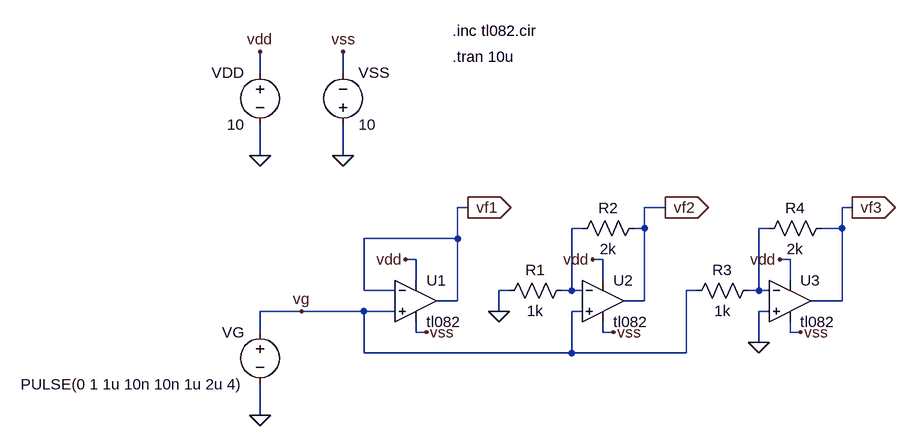
[diagram p0: schematic Experiment_01.asc]
Experiment_01.asc, the LTspice schematic file:
Version 4
SHEET 1 948 680
WIRE -64 -176 -64 -208
WIRE 64 -176 64 -208
WIRE -64 -48 -64 -96
WIRE 64 -48 64 -96
WIRE 256 32 240 32
WIRE 560 32 528 32
WIRE 848 32 832 32
WIRE 432 64 416 64
WIRE 528 64 528 32
WIRE 528 64 512 64
WIRE 720 64 704 64
WIRE 832 64 832 32
WIRE 832 64 800 64
WIRE 240 80 240 32
WIRE 240 80 96 80
WIRE 176 112 160 112
WIRE 464 112 448 112
WIRE 752 112 736 112
WIRE 176 144 176 112
WIRE 464 144 464 112
WIRE 752 144 752 112
WIRE 96 160 96 80
WIRE 144 160 96 160
WIRE 320 160 304 160
WIRE 416 160 416 64
WIRE 416 160 400 160
WIRE 432 160 416 160
WIRE 608 160 592 160
WIRE 704 160 704 64
WIRE 704 160 688 160
WIRE 720 160 704 160
WIRE 240 176 240 80
WIRE 240 176 208 176
WIRE 528 176 528 64
WIRE 528 176 496 176
WIRE 832 176 832 64
WIRE 832 176 784 176
WIRE 0 192 -64 192
WIRE 96 192 0 192
WIRE 144 192 96 192
WIRE 304 192 304 160
WIRE 432 192 416 192
WIRE 720 192 704 192
WIRE -64 224 -64 192
WIRE 176 224 176 208
WIRE 192 224 176 224
WIRE 464 224 464 208
WIRE 480 224 464 224
WIRE 752 224 752 208
WIRE 768 224 752 224
WIRE 704 240 704 192
WIRE 96 256 96 192
WIRE 416 256 416 192
WIRE 416 256 96 256
WIRE 592 256 592 160
WIRE 592 256 416 256
WIRE -64 352 -64 304
FLAG -64 352 0
FLAG 304 192 0
FLAG 704 240 0
FLAG -64 -48 0
FLAG 64 -48 0
FLAG -64 -208 vdd
FLAG 160 112 vdd
FLAG 64 -208 vss
FLAG 192 224 vss
FLAG 448 112 vdd
FLAG 736 112 vdd
FLAG 480 224 vss
FLAG 768 224 vss
FLAG 256 32 vf1
IOPIN 256 32 Out
FLAG 560 32 vf2
IOPIN 560 32 Out
FLAG 848 32 vf3
IOPIN 848 32 Out
FLAG 0 192 vg
SYMBOL res 416 144 R90
WINDOW 0 0 56 VBottom 2
WINDOW 3 32 56 VTop 2
SYMATTR InstName R1
SYMATTR Value 1k
SYMBOL res 528 48 R90
WINDOW 0 0 56 VBottom 2
WINDOW 3 32 56 VTop 2
SYMATTR InstName R2
SYMATTR Value 2k
SYMBOL res 704 144 R90
WINDOW 0 0 56 VBottom 2
WINDOW 3 32 56 VTop 2
SYMATTR InstName R3
SYMATTR Value 1k
SYMBOL res 816 48 R90
WINDOW 0 0 56 VBottom 2
WINDOW 3 32 56 VTop 2
SYMATTR InstName R4
SYMATTR Value 2k
SYMBOL voltage -64 208 M0
WINDOW 123 0 0 Left 0
WINDOW 39 0 0 Left 0
SYMATTR InstName VG
SYMATTR Value PULSE(0 1 1u 10n 10n 1u 2u 4)
SYMBOL voltage -64 -192 M0
SYMATTR InstName VDD
SYMATTR Value 10
SYMBOL voltage 64 -80 M180
WINDOW 0 24 96 Left 2
WINDOW 3 24 16 Left 2
SYMATTR InstName VSS
SYMATTR Value 10
SYMBOL Opamps\\opamp2 176 112 R0
SYMATTR InstName U1
SYMATTR Value tl082
SYMBOL Opamps\\opamp2 464 112 R0
SYMATTR InstName U2
SYMATTR Value tl082
SYMBOL Opamps\\opamp2 752 112 R0
SYMATTR InstName U3
SYMATTR Value tl082
TEXT 232 -240 Left 2 !.inc tl082.cir
TEXT 232 -200 Left 2 !.tran 10u

The netlist it stands for:
* Experiment_01.asc
R1 N001 0 1k
R2 vf2 N001 2k
R3 N002 vg 1k
R4 vf3 N002 2k
VG vg 0 PULSE(0 1 1u 10n 10n 1u 2u 4)
VDD vdd 0 10
VSS 0 vss 10
XU1 vg vf1 vdd vss vf1 tl082  ; pins In+ In- V+ V- OUT
XU2 vg N001 vdd vss vf2 tl082  ; pins In+ In- V+ V- OUT
XU3 0 N002 vdd vss vf3 tl082  ; pins In+ In- V+ V- OUT
.inc tl082.cir
.tran 10u
.backanno
.end